# EAGLE design mSniff_v01 (EAGLE 9.6.2)

## Sheet 1 of 2
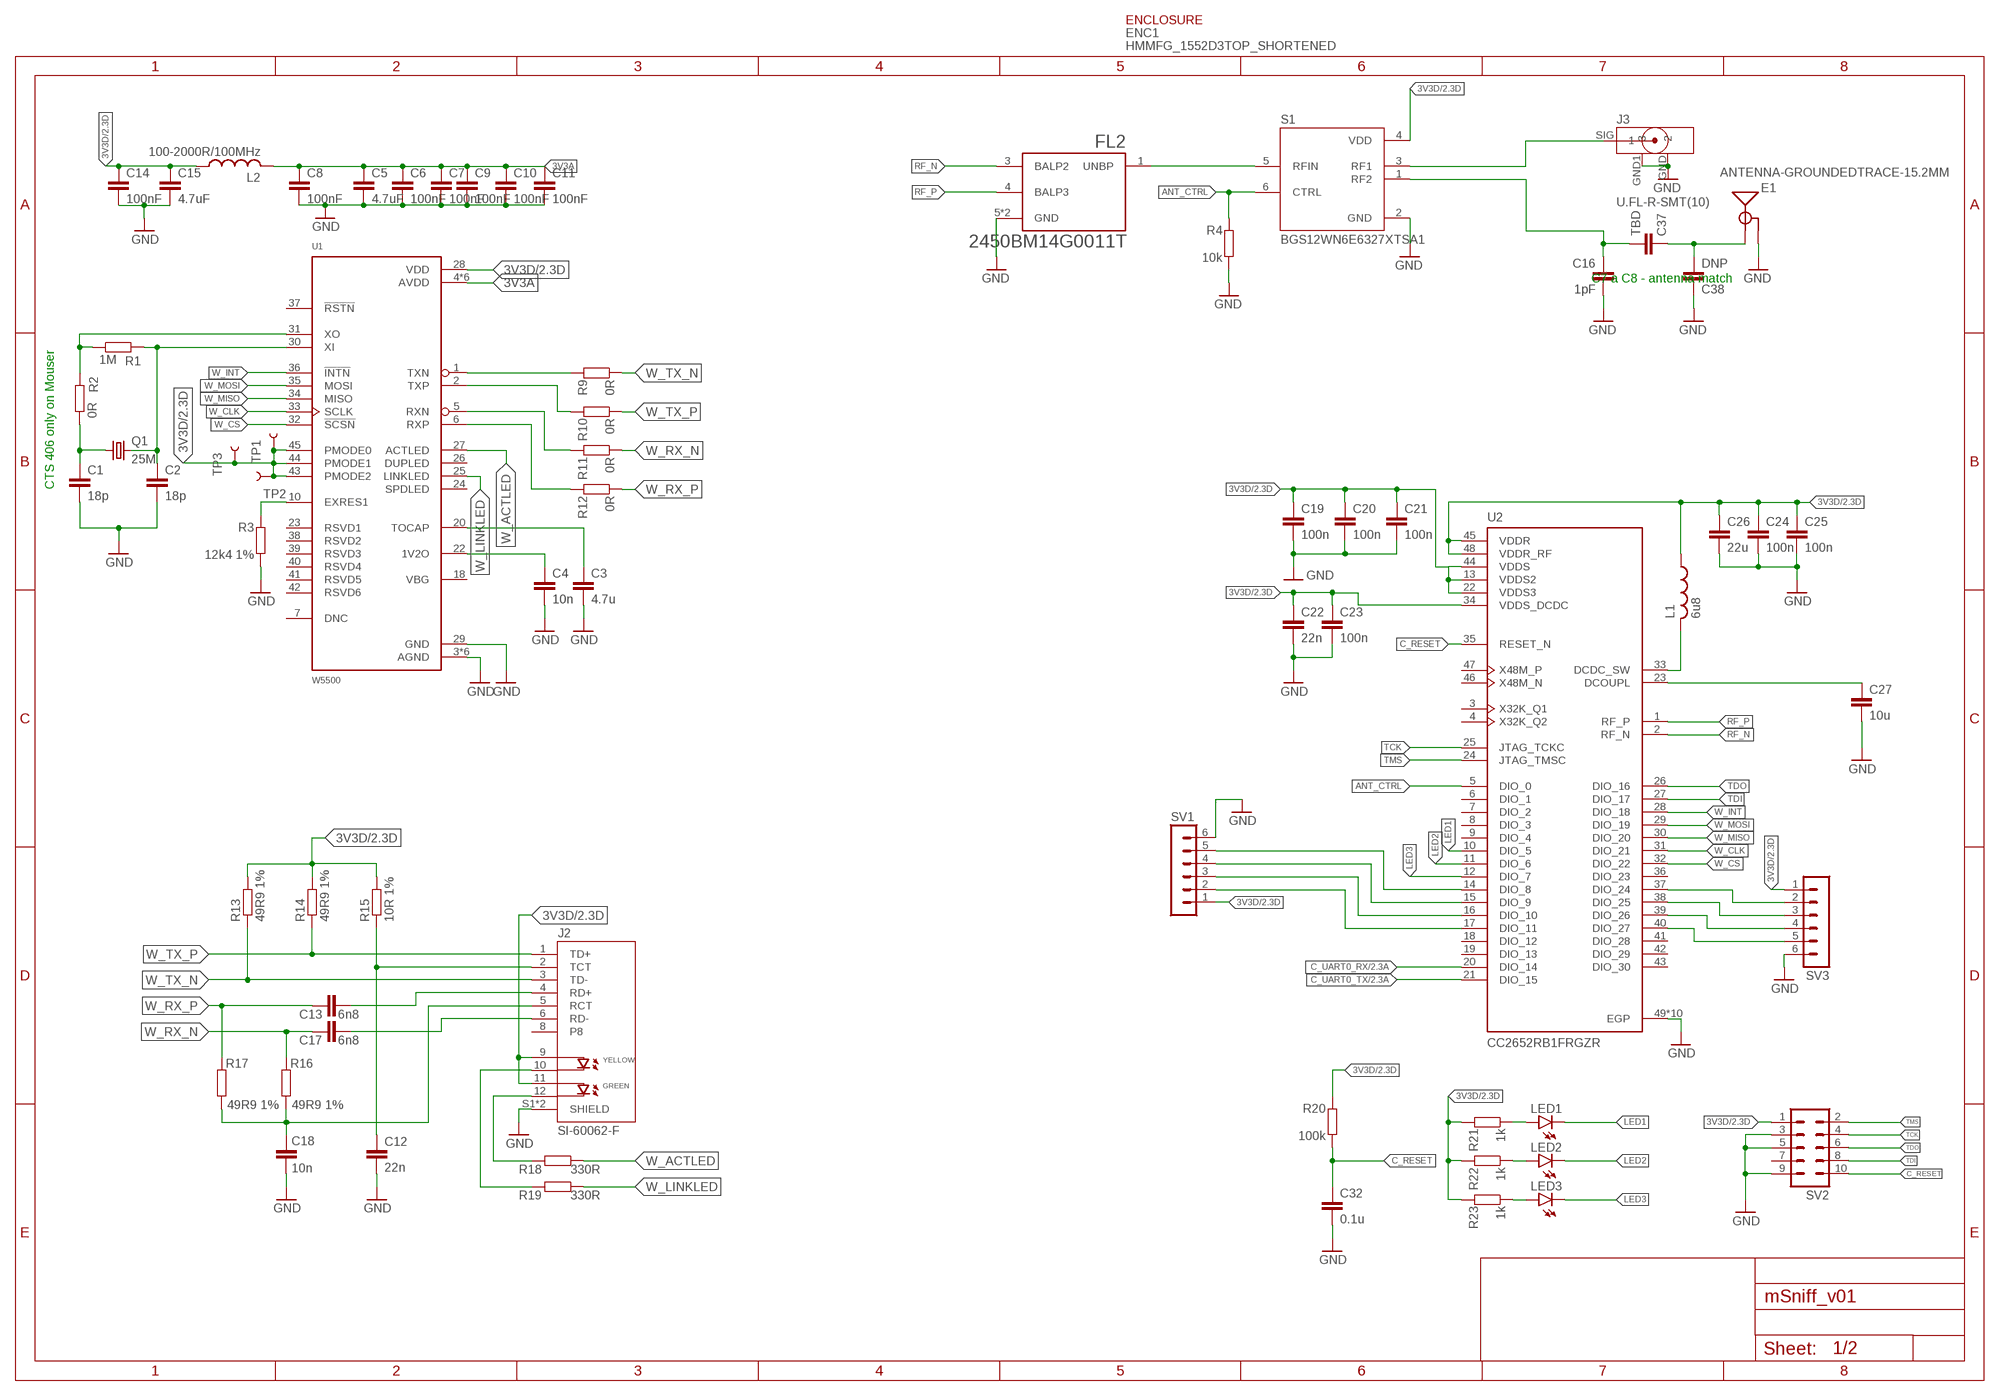
[diagram p0: schematic, sheet 1]

### Parts
C1  18p  C_0603REC  [0603REC_C]
C2  18p  C_0603REC  [0603REC_C]
C3  4.7u  C_0603REC  [0603REC_C]
C4  10n  C_0603REC  [0603REC_C]
C5  4.7uF  C_0805REC  [0805REC_C]
C6  100nF  C_0603REC  [0603REC_C]
C7  100nF  C_0603REC  [0603REC_C]
C8  100nF  C_0603REC  [0603REC_C]
C9  100nF  C_0603REC  [0603REC_C]
C10  100nF  C_0603REC  [0603REC_C]
C11  100nF  C_0603REC  [0603REC_C]
C12  22n  C_0603REC  [0603REC_C]
C13  6n8  C_0603REC  [0603REC_C]
C14  100nF  C_0603REC  [0603REC_C]
C15  4.7uF  C_0805REC  [0805REC_C]
C16  1pF  C_0402REC  [0402REC_C]
C17  6n8  C_0603REC  [0603REC_C]
C18  10n  C_0603REC  [0603REC_C]
C19  100n  C_0603REC  [0603REC_C]
C20  100n  C_0603REC  [0603REC_C]
C21  100n  C_0603REC  [0603REC_C]
C22  22n  C_0603REC  [0603REC_C]
C23  100n  C_0603REC  [0603REC_C]
C24  100n  C_0603REC  [0603REC_C]
C25  100n  C_0603REC  [0603REC_C]
C26  22u  C_0603REC  [0603REC_C]
C27  10u  C_0603REC  [0603REC_C]
C32  0.1u  C_0603REC  [0603REC_C]
C37  TBD  C_0402REC  [0402REC_C]
C38  DNP  C_0402REC  [0402REC_C]
E1  ANTENNA-GROUNDEDTRACE-15.2MM  [TRACE_ANTENNA_2.4GHZ_15.2MM]
ENC1  HMMFG_1552D3TOP_SHORTENED  [1552D3_TOP_SHORT]
FL2  2450BM14G0011T  [BALUN_2450BM14G0011T]
J2  SI-60062-F  [BEL_SI-60062-F]
J3  U.FL-R-SMT(10)  [U.FL-R-SMT(10)]
L1  6u8  L_0805REC  [0805REC_L]
L2  100-2000R/100MHz  L_0603REC  [0603REC_L]
LED1  LEDCHIPLED_0603  [CHIPLED_0603]
LED2  LEDCHIPLED_0603  [CHIPLED_0603]
LED3  LEDCHIPLED_0603  [CHIPLED_0603]
Q1  25M  CRYSTALCTS406  [CTS406]
R1  1M  R_0603REC  [0603REC_R]
R2  0R  R_0603REC  [0603REC_R]
R3  12k4 1%  R_0603REC  [0603REC_R]
R4  10k  R_0603REC  [0603REC_R]
R9  0R  R_0603REC  [0603REC_R]
R10  0R  R_0603REC  [0603REC_R]
R11  0R  R_0603REC  [0603REC_R]
R12  0R  R_0603REC  [0603REC_R]
R13  49R9 1%  R_0603REC  [0603REC_R]
R14  49R9 1%  R_0603REC  [0603REC_R]
R15  10R 1%  R_0603REC  [0603REC_R]
R16  49R9 1%  R_0603REC  [0603REC_R]
R17  49R9 1%  R_0603REC  [0603REC_R]
R18  330R  R_0603REC  [0603REC_R]
R19  330R  R_0603REC  [0603REC_R]
R20  100k  R_0603REC  [0603REC_R]
R21  1k  R_0603REC  [0603REC_R]
R22  1k  R_0603REC  [0603REC_R]
R23  1k  R_0603REC  [0603REC_R]
S1  BGS12WN6E6327XTSA1  [SW_BGS12WN6E6327XTSA1]
SV1  MA06-1  [MA06-1]
SV2  MA05-2SMD127  [MA05-2-SMD127-GPEC214]
SV3  MA06-1  [MA06-1]
TP1  TEST-POINT3  [PAD.03X.03]
TP2  TEST-POINT3  [PAD.03X.03]
TP3  TEST-POINT3  [PAD.03X.03]
U1  W5500  [QFP50P900X900X160-48N]
U2  CC2652RB1FRGZR  [QFN50P700X700X100-49N]

### Nets
3V3A: C5.1 C6.1 C7.1 C8.1 C9.1 C10.1 C11.1 L2.2 U1.4(AVDD) U1.8(AVDD) U1.11(AVDD) U1.15(AVDD) U1.17(AVDD) U1.21(AVDD)
3V3D: C14.1 C15.1 C19.1 C20.1 C21.1 C22.1 C23.1 C24.1 C25.1 C26.1 J2.9(YA) J2.11(GA) L1.1 L2.1 R13.2 R14.2 R15.2 R20.2 R21.2 R22.2 R23.2 S1.4(VDD) SV1.1 SV2.1 SV3.1 TP1.P$1 TP2.P$1 TP3.P$1 U1.28(VDD) U1.43(PMODE2) U1.44(PMODE1) U1.45(PMODE0) U2.13(VDDS2) U2.22(VDDS3) U2.34(VDDS_DCDC) U2.44(VDDS) U2.45(VDDR) U2.48(VDDR_RF) ; also sheet 2
ANT_CTRL: R4.2 S1.6(CTRL) U2.5(DIO_0)
C_RESET: C32.1 R20.1 SV2.10 U2.35(RESET_N)
C_UART0_RX: U2.20(DIO_14) ; also sheet 2
C_UART0_TX: U2.21(DIO_15) ; also sheet 2
GND: C1.2 C2.2 C3.2 C4.2 C5.2 C6.2 C7.2 C8.2 C9.2 C10.2 C11.2 C12.2 C14.2 C15.2 C16.2 C18.1 C19.2 C20.2 C21.2 C22.2 C23.2 C24.2 C25.2 C26.2 C27.2 C32.2 C38.1 E1.GND FL2.5(GND) FL2.6(GND) J2.S1(SHIELD) J2.S2(SHIELD) J3.GND J3.GND1 R3.1 R4.1 S1.2(GND) SV1.6 SV2.3 SV2.5 SV2.9 SV3.6 U1.3(AGND) U1.9(AGND) U1.14(AGND) U1.16(AGND) U1.19(AGND) U1.29(GND) U1.48(AGND) U2.49(EGP) U2.50(EGP) U2.51(EGP) U2.52(EGP) U2.53(EGP) U2.54(EGP) U2.55(EGP) U2.56(EGP) U2.57(EGP) U2.58(EGP) ; also sheet 2
LED1: LED1.C U2.10(DIO_5)
LED2: LED2.C U2.11(DIO_6)
LED3: LED3.C U2.12(DIO_7)
N$1: C2.1 Q1.3 R1.2 U1.30(XI)
N$2: R1.1 R2.2 U1.31(XO)
N$3: C1.1 Q1.1 R2.1
N$4: C4.1 U1.22(1V2O)
N$5: R3.2 U1.10(EXRES1)
N$6: C16.1 C37.2 S1.1(RF2)
N$7: C3.1 U1.20(TOCAP)
N$8: SV1.5 U2.14(DIO_8)
N$9: FL2.1(UNBP) S1.5(RFIN)
N$10: SV1.4 U2.15(DIO_9)
N$11: SV1.3 U2.16(DIO_10)
N$12: SV1.2 U2.17(DIO_11)
N$13: J3.SIG S1.3(RF1)
N$14: SV3.2 U2.37(DIO_24)
N$15: C37.1 C38.2 E1.ANT(SIGNAL)
N$16: SV3.3 U2.38(DIO_25)
N$17: SV3.4 U2.39(DIO_26)
N$18: C12.1 J2.2(TCT) R15.1
N$19: SV3.5 U2.40(DIO_27)
N$20: C27.1 U2.23(DCOUPL)
N$21: J2.12(GK) R18.2
N$22: C18.2 J2.5(RCT) R16.1 R17.1
N$23: J2.10(YK) R19.2
N$25: L1.2 U2.33(DCDC_SW)
N$29: LED1.A R21.1
N$31: LED2.A R22.1
N$32: LED3.A R23.1
RD_N [Ether]: C17.2 J2.6(RD-)
RD_P [Ether]: C13.2 J2.4(RD+)
RF_N: FL2.3(BALP2) U2.2(RF_N)
RF_P: FL2.4(BALP3) U2.1(RF_P)
RX_N [Ether]: R11.2 U1.5(RXN)
RX_P [Ether]: R12.2 U1.6(RXP)
TCK: SV2.4 U2.25(JTAG_TCKC)
TDI: SV2.8 U2.27(DIO_17)
TDO: SV2.6 U2.26(DIO_16)
TMS: SV2.2 U2.24(JTAG_TMSC)
TX_N [Ether]: R9.2 U1.1(TXN)
TX_P [Ether]: R10.2 U1.2(TXP)
W_ACTLED: R18.1 U1.27(ACTLED)
W_CLK: U1.33(SCLK) U2.31(DIO_21)
W_CS: U1.32(!SCSN) U2.32(DIO_22)
W_INT: U1.36(!INTN) U2.28(DIO_18)
W_LINKLED: R19.1 U1.25(LINKLED)
W_MISO: U1.34(MISO) U2.30(DIO_20)
W_MOSI: U1.35(MOSI) U2.29(DIO_19)
W_RX_N [Ether]: C17.1 R11.1 R16.2
W_RX_P [Ether]: C13.1 R12.1 R17.2
W_TX_N [Ether]: J2.3(TD-) R9.1 R13.1
W_TX_P [Ether]: J2.1(TD+) R10.1 R14.1
Unconnected: J2.8 SV2.7 U1.7(DNC) U1.18(VBG) U1.23(RSVD1) U1.24(SPDLED) U1.26(DUPLED) U1.37(!RSTN) U1.38(RSVD2) U1.39(RSVD3) U1.40(RSVD4) U1.41(RSVD5) U1.42(RSVD6) U2.3(X32K_Q1) U2.4(X32K_Q2) U2.6(DIO_1) U2.7(DIO_2) U2.8(DIO_3) U2.9(DIO_4) U2.18(DIO_12) U2.19(DIO_13) U2.36(DIO_23) U2.41(DIO_28) U2.42(DIO_29) U2.43(DIO_30) U2.46(X48M_N) U2.47(X48M_P)

### Notes on the sheet
- C7 a C8 - antenna match
- CTS 406 only on Mouser

## Sheet 2 of 2
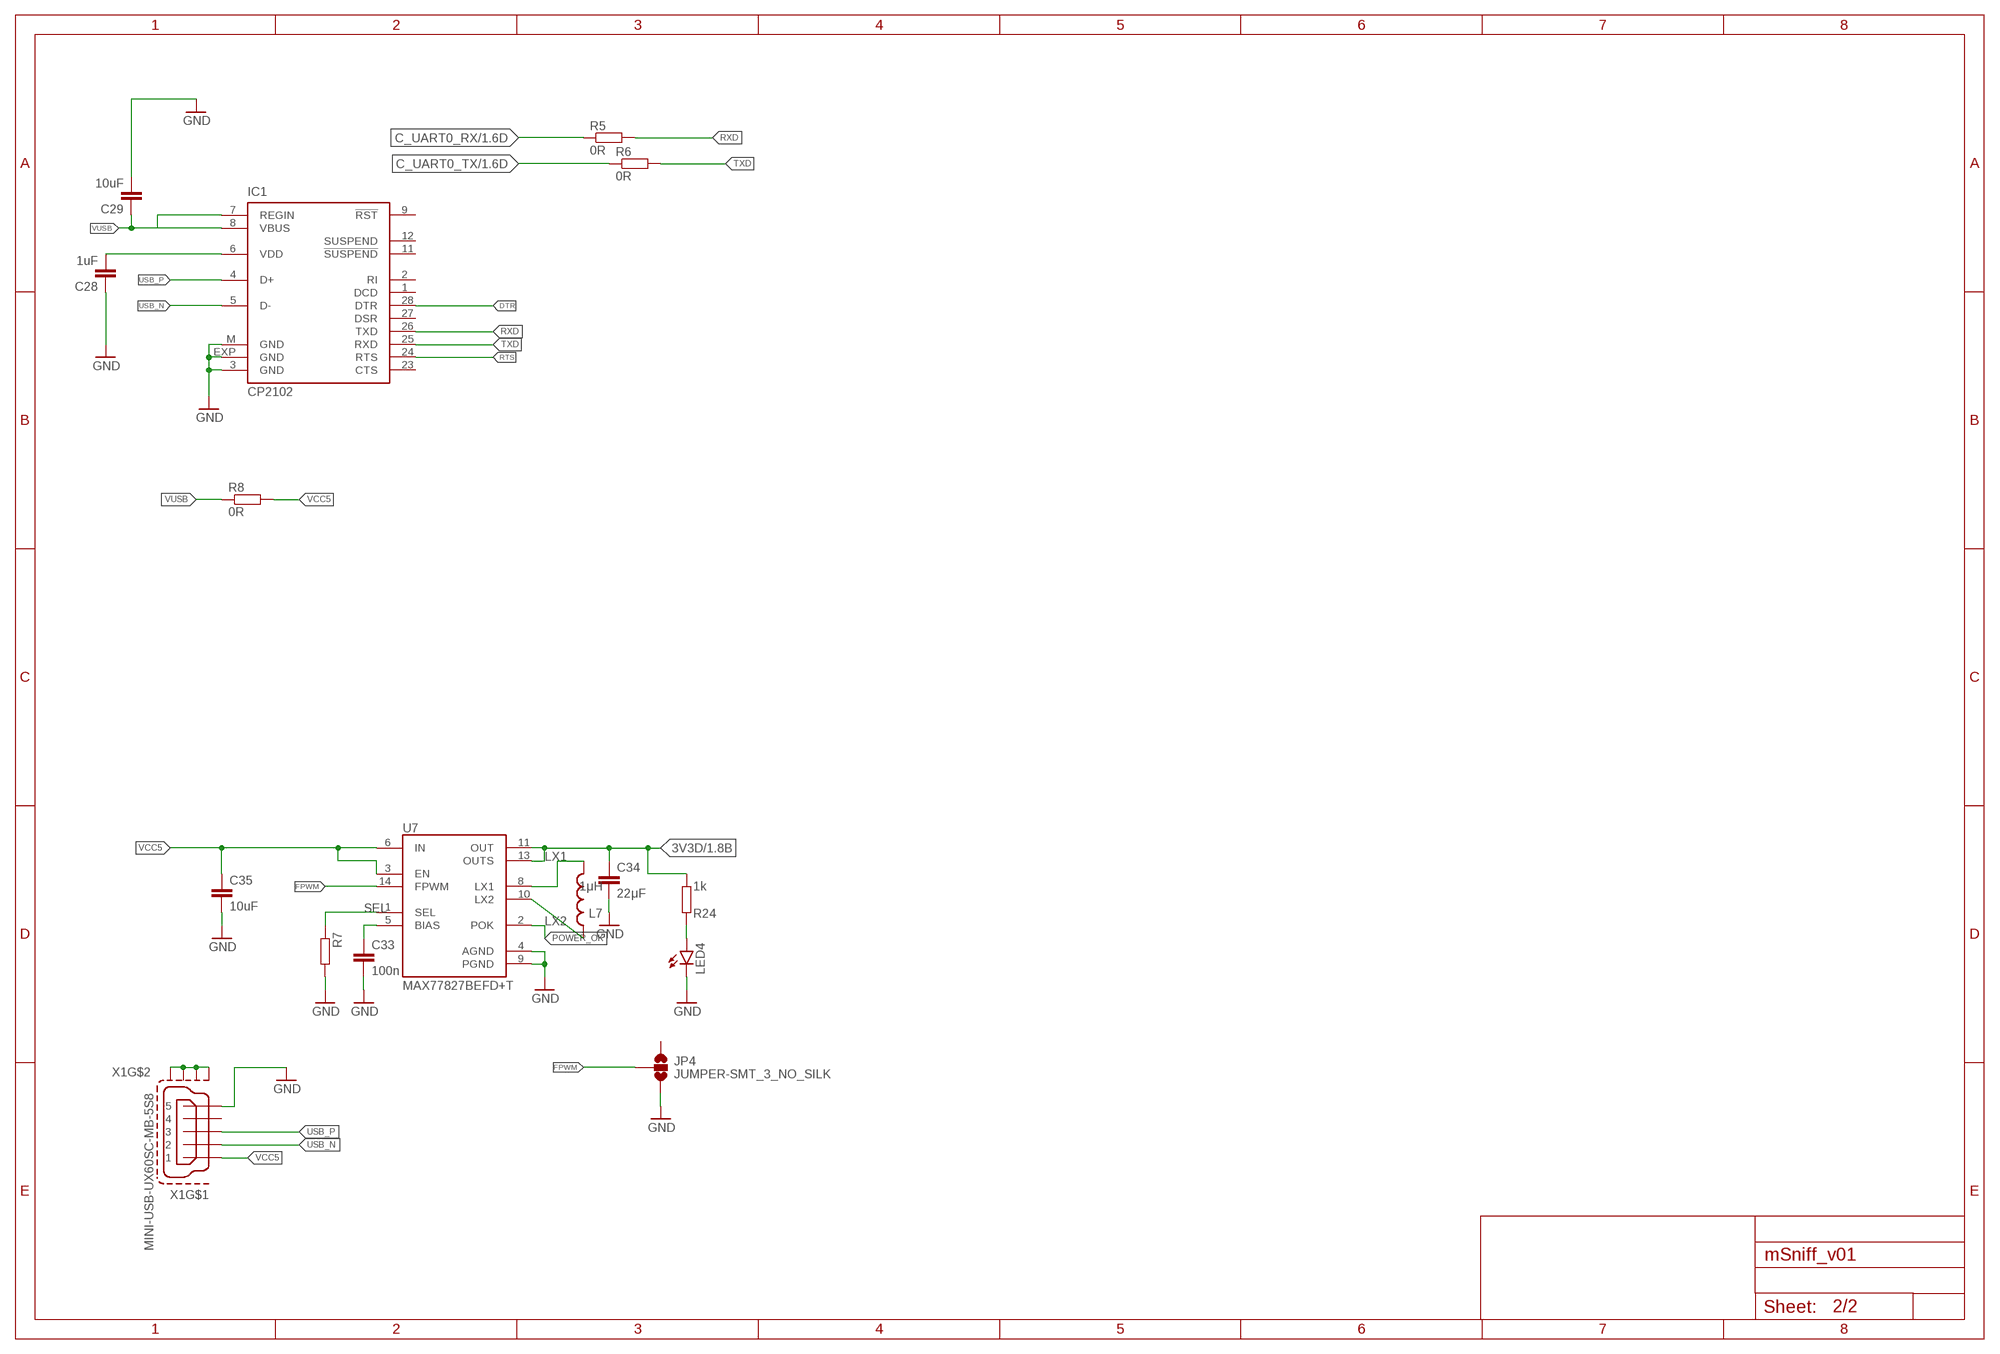
[diagram p1: schematic, sheet 2]

### Parts
C28  1uF  C_0603REC  [0603REC_C]
C29  10uF  C_0603REC  [0603REC_C]
C33  100n  C_0603REC  [0603REC_C]
C34  22μF  C_0603REC  [0603REC_C]
C35  10uF  C_0603REC  [0603REC_C]
IC1  CP2102  [MLP28]
JP4  JUMPER-SMT_3_NO_SILK  [SMT-JUMPER_3_NO_SILK]
L7  1μH  L_1008REC  [1008REC_L]
LED4  LEDCHIPLED_0603  [CHIPLED_0603]
R5  0R  R_0603REC  [0603REC_R]
R6  0R  R_0603REC  [0603REC_R]
R7  R_0603REC  [0603REC_R]
R8  0R  R_0603REC  [0603REC_R]
R24  1k  R_0603REC  [0603REC_R]
U7  MAX77827BEFD+T  [CONV_MAX77827BEFD+T]
X1  MINI-USB-UX60SC-MB-5S8  [HIROSE_UX60SC-MB-5S8]

### Nets
3V3D: C34.1 R24.1 U7.11(OUT) U7.13(OUTS) ; also sheet 1
BIAS: C33.1 U7.5(BIAS)
C_UART0_RX: R5.1 ; also sheet 1
C_UART0_TX: R6.1 ; also sheet 1
DTR: IC1.28(DTR)
FPWM: JP4.2 U7.14(FPWM)
GND: C28.1 C29.2 C33.2 C34.2 C35.2 IC1.3(GND) IC1.EXP(GND) IC1.M(GND) JP4.3 LED4.C R7.2 U7.4(AGND) U7.9(PGND) X1.5 ; also sheet 1
LX1: L7.2 U7.8(LX1)
LX2: L7.1 U7.10(LX2)
N$24: LED4.A R24.2
N$27: X1.S1 X1.S2 X1.S3 X1.S4
N$30: C28.2 IC1.6(VDD)
POWER_OK: U7.2(POK)
RTS: IC1.24(RTS)
RXD: IC1.26(TXD) R5.2
SEL: R7.1 U7.1(SEL)
TXD: IC1.25(RXD) R6.2
USB_N [USB]: IC1.5(D-) X1.2
USB_P [USB]: IC1.4(D+) X1.3
VCC5: C35.1 R8.2 U7.3(EN) U7.6(IN) X1.1
VUSB: C29.1 IC1.7(REGIN) IC1.8(VBUS) R8.1
Unconnected: IC1.1(DCD) IC1.2(RI) IC1.9(!RST) IC1.11(!SUSPEND) IC1.12(SUSPEND) IC1.23(CTS) IC1.27(DSR) JP4.1 X1.4

## Library data of the parts
C1-C29 C32-C35 C37 C38 = rcl-reflow-pads:C_: Capacitors with recommended reflow pad dimensions (to prevent tombstoning)
E1 = SparkFun-RF:ANTENNA-GROUNDED: Antenna w/ Ground Connection 2.4GHz antennae with signal and ground terminals. TRACE_ANTENNA_2.4GHZ_15.2MM - Meander Trace antenna 15.2 x 5.7mm footprint Based on layout from TI app note AN043 <http://www.ti.com/lit/an/swra117d/swra117d.pdf>. TRACE_ANTENNA_2.4GHZ_25.7MM - Inverted F trace antenna 25.7 x 7.5 mm footprint. Based on layout from TI design note DN0007 <http://www.ti.com/lit/an/swru120b/swru120b.pdf>.
ENC1 = O_enclosures:HMMFG_1552D3
FL2 = O_Anteny:2450BM14G0011T: BALUN-BPF TI CC2640 CC2650 MATCH Check prices <https://pricing.snapeda.com/parts/2450BM14G0011T/Johanson%20Technology/view-part?ref=eda>; AVAILABILITY: Warning; DESCRIPTION: RF Balun 2.4GHz ~ 2.5GHz 50 / -Ohm 0603 (1608 Metric); MF: Johanson Technology; MP: 2450BM14G0011T; PACKAGE: 0603 Johanson; PRICE: None; PURCHASE-URL: https://pricing.snapeda.com/search/part/2450BM14G0011T/?ref=eda
IC1 = mega_board:CP210*: Single-Chip USB to UART Bridge Source: www.silabs.com .. CP2101.pdf / cp2102.pdf; MF: FARNELL; MPN: CP2102-GM; OC_FARNELL: 9282130; OC_NEWARK: 30K5635
J2 = SI-60062-F:SI-60062-F: 1 Port RJ45 Magjack Connector Through Hole 10/100 Base-T, AutoMDIX Check prices <https://pricing.snapeda.com/parts/SI-60062-F/Bel%20Magnetic%20Solutions/view-part?ref=eda>; AVAILABILITY: Warning; DESCRIPTION: Conn RJ-45 RCP 8 POS 2.54mm Solder RA Thru-Hole 12 Terminal 1 Port; MF: Bel Magnetic Solutions; MP: SI-60062-F; PACKAGE: None; PRICE: None; PURCHASE-URL: https://pricing.snapeda.com/search/part/SI-60062-F/?ref=eda
J3 = Connectors:U.FL-R-SMT(10): CONN U.FL RCPT STR 50 OHM SMD Manufacturer's datasheet <https://media.digikey.com/pdf/Data%20Sheets/Hirose%20PDFs/UFL%20Series.pdf>; CREATED_BY: PCBLayout.com; DIGIKEY_PART_NUMBER: H9161CT-ND; MANUFACTURER: Hirose Electric Co Ltd; MPN: U.FL-R-SMT(10); PACKAGE: SMD
JP4 = O_test_solpad:JUMPER-SMT_3_NO: Normally open jumper This jumper has three pads in close proximity to each other. Apply solder to close the connection(s).
L1 L2 L7 = rcl-reflow-pads:L_: Inductors with recommended reflow pad dimensions (to prevent tombstoning)
LED1-LED4 = O_semicon:LED: LED OSRAM: - CHIPLED LG R971, LG N971, LY N971, LG Q971, LY Q971, LO R971, LY R971 LH N974, LH R974 LS Q976, LO Q976, LY Q976 LO Q996 - Hyper CHIPLED LW Q18S LB Q993, LB Q99A, LB R99A - SideLED LS A670, LO A670, LY A670, LG A670, LP A670 LB A673, LV A673, LT A673, LW A673 LH A674 LY A675 LS A676, LA A676, LO A676, LY A676, LW A676 LS A679, LY A679, LG A679 - Hyper Micro SIDELED® LS Y876, LA Y876, LO Y876, LY Y876 LT Y87S - SmartLED LW L88C, LW L88S LB L89C, LB L89S, LG L890 LS L89K, LO L89K, LY L89K LS L896, LA L896, LO L896, LY L896 - TOPLED LS T670, LO T670, LY T670, LG T670, LP T670 LSG T670, LSP T670, LSY T670, LOP T670, LYG T670 LG T671, LOG T671, LSG T671 LB T673, LV T673, LT T673, LW T673 LH T674 LS T676, LA T676, LO T676, LY T676, LB T676, LH T676, LSB T676, LW T676 LB T67C, LV T67C, LT T67C, LS T67K, LO T67K, LY T67K, LW E67C LS E67B, LA E67B, LO E67B, LY E67B, LB E67C, LV E67C, LT E67C LW T67C LS T679, LY T679, LG T679 LS T770, LO T770, LY T770, LG T770, LP T770 LB T773, LV T773, LT T773, LW T773 LH T774 LS E675, LA E675, LY E675, LS T675 LS T776, LA T776, LO T776, LY T776, LB T776 LHGB T686 LT T68C, LB T68C - Hyper Mini TOPLED® LB M676 - Mini TOPLED Santana® LG M470 LS M47K, LO M47K, LY M47K Source: http://www.osram.convergy.de LUXEON: - LUMILED® LXK2-PW12-R00, LXK2-PW12-S00, LXK2-PW14-U00, LXK2-PW14-V00 LXK2-PM12-R00, LXK2-PM12-S00, LXK2-PM14-U00 LXK2-PE12-Q00, LXK2-PE12-R00, LXK2-PE12-S00, LXK2-PE14-T00, LXK2-PE14-U00 LXK2-PB12-K00, LXK2-PB12-L00, LXK2-PB12-M00, LXK2-PB14-N00, LXK2-PB14-P00, LXK2-PB14-Q00 LXK2-PR12-L00, LXK2-PR12-M00, LXK2-PR14-Q00, LXK2-PR14-R00 LXK2-PD12-Q00, LXK2-PD12-R00, LXK2-PD12-S00 LXK2-PH12-R00, LXK2-PH12-S00 LXK2-PL12-P00, LXK2-PL12-Q00, LXK2-PL12-R00 Source: www.luxeon.com KINGBRIGHT: KA-3528ASYC Source: www.kingbright.com
Q1 = crystal:CRYSTAL: CRYSTAL; OC_FARNELL: unknown; OC_NEWARK: unknown
R1-R24 = rcl-reflow-pads:R_: Resistors with recommended reflow pad dimensions (to prevent tombstoning)
S1 = O_Anteny:BGS12WN6E6327XTSA1: RF Switch SPDT 50MHz to 6GHz 21dB T/R Check prices <https://pricing.snapeda.com/parts/BGS12WN6E6327XTSA1/Infineon%20Technologies/view-part?ref=eda>; AVAILABILITY: In Stock; DESCRIPTION: RF Switch IC WLAN SPDT 50Ohm PG-TSNP-6-10; MF: Infineon Technologies; MP: BGS12WN6E6327XTSA1; PACKAGE: TSNP-6 Infineon Technologies; PRICE: None; PURCHASE-URL: https://pricing.snapeda.com/search/part/BGS12WN6E6327XTSA1/?ref=eda
SV1 SV3 = O_Header:MA06-1: PIN HEADER; OC_FARNELL: unknown; OC_NEWARK: unknown
SV2 = O_Header:MA05-2: PIN HEADER
TP1-TP3 = O_test_solpad:TEST-POINT: SparkFun Test Points Bare copper test points for troubleshooting or In-Circuit-Testing. These are used by our Production team for verifying production board runs using pogo-pins on test beds. SparkFun Products: SparkFun LSM9DS1 Breakout <https://www.sparkfun.com/products/13284> SparkFun PSOC <https://www.sparkfun.com/products/13714> SparkFun Load Cell Amplifier <https://www.sparkfun.com/products/13879>
U1 = W5500:W5500: Hardwired TCP/IP embedded Ethernet controller Check availability <https://pricing.snapeda.com/parts/W5500/WIZnet/view-part?ref=eda>; AVAILABILITY: In Stock; DESCRIPTION: Ethernet Controller 10/100 Base-T/TX PHY SPI Interface 48-LQFP (7x7); MF: WIZnet; MP: W5500; PACKAGE: LQFP-48 WIZnet; PRICE: None; PURCHASE-URL: https://pricing.snapeda.com/search/part/W5500/?ref=eda
U2 = CC2652RB1FRGZR:CC2652RB1FRGZR: Check availability <https://pricing.snapeda.com/parts/CC2652RB1FRGZR/Texas%20Instruments/view-part?ref=eda>; AVAILABILITY: In Stock; DESCRIPTION: SimpleLink™ 32-bit Arm Cortex-M4F multiprotocol 2.4 GHz wireless MCU with crystal-less BAW resonator; MF: Texas Instruments; MP: CC2652RB1FRGZR; PACKAGE: VQFN-48 Texas Instruments; PRICE: None; PURCHASE-URL: https://pricing.snapeda.com/search/part/CC2652RB1FRGZR/?ref=eda
U7 = MAX77827BEFD_T:MAX77827BEFD+T: Buck-Boost Switching Regulator IC Positive Adjustable 2.3V 1 Output 1.6A 14-PowerUFQFN Check availability <https://pricing.snapeda.com/parts/MAX77827BEFD%2BT/Analog%20Devices/view-part?ref=eda>; AVAILABILITY: In Stock; DESCRIPTION: 5.5V Input, 1.8A/3.1A Switch Buck-Boost Converter with 6μA IQ; MF: Analog Devices; MP: MAX77827BEFD+T; PACKAGE: None; PRICE: None; PURCHASE-URL: https://pricing.snapeda.com/search/part/MAX77827BEFD+T/?ref=eda
X1 = O_Sw_Conn_Head:MINI-USB-: MINI USB Connector Source: http://www.hirose.co.jp/cataloge_hp/e24000019.pdf

## Net classes
1 USB: width 0.3 mm, clearance 0.127 mm
2 Ether: width 0.3 mm, clearance 0.127 mm

## Board
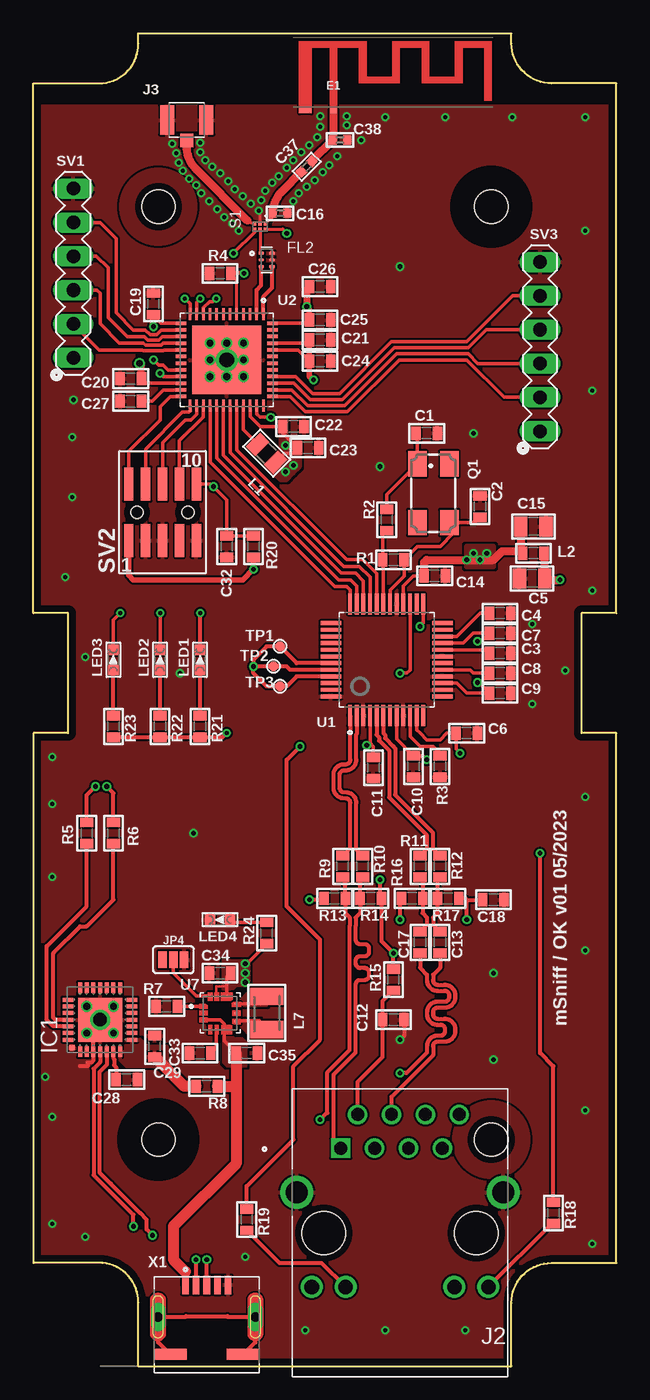
[diagram p2: board, top side]
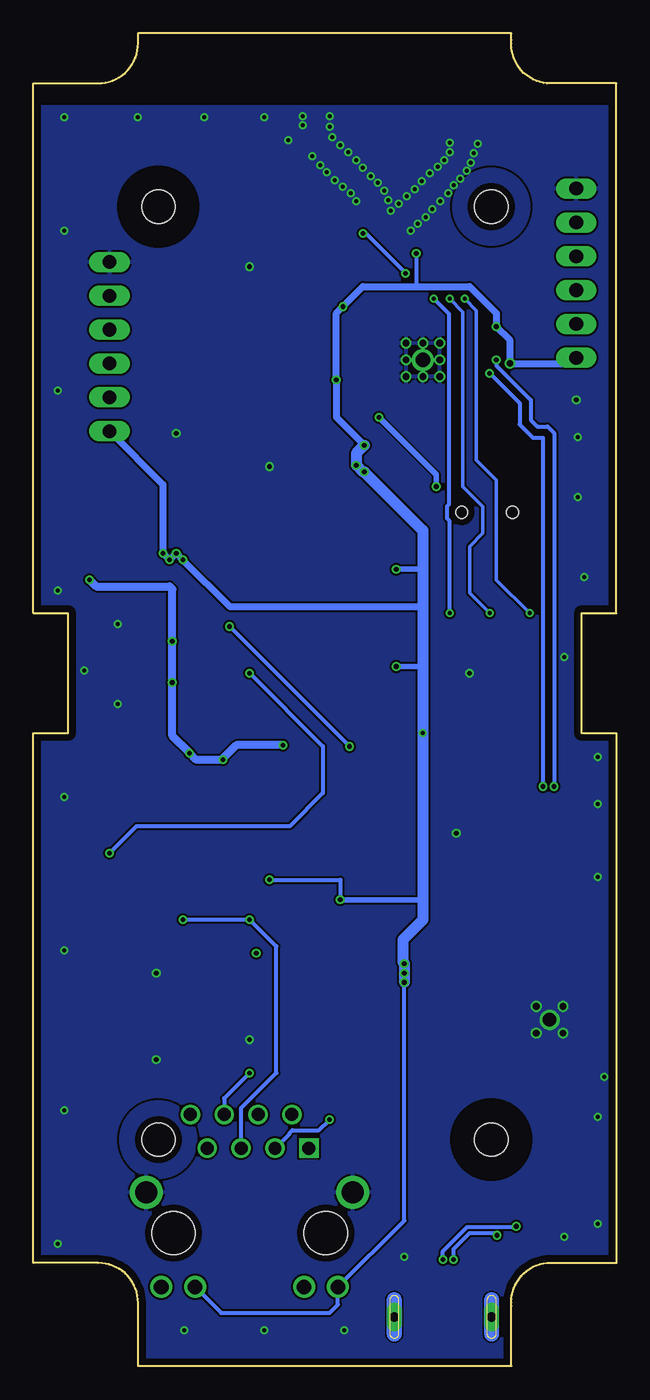
[diagram p3: board, bottom side, seen from below]

Size 43.72 x 100 mm. Coordinates in mm from the lower left corner, seen from the top.
Copper layers (1*16): Top 0.035mm / dielectric 1.5mm / Bottom 0.035mm
Design rules "2 vrstvy trida 6": minimum track width 0.15mm, minimum drill 0.3mm, track to track 0.15mm, track to pad 0.15mm, pad to pad 0.15mm, via to via 0.15mm, smd to smd 0.15mm, copper to edge 0.5mm, drill to drill 0.3mm, minimum pad ring 0.15mm, minimum via ring 0.15mm, stop-mask expansion 0.1mm, vias tented up to drill 3mm, thermal gap 0.15mm

### Footprints (pad centres in the part's own frame; a part is rotated, then mirrored left to right if it is on the bottom)
0603REC_C = smd 0.7 x 1: 1 -0.8,0; 2 0.8,0
0805REC_C = smd 1 x 1.5: 1 -0.95,0; 2 0.95,0
0402REC_C = smd 0.6 x 0.7: 1 -0.55,0; 2 0.55,0
TRACE_ANTENNA_2.4GHZ_15.2MM = smd 0.5 x 0.5: ANT 0,-0.25 | smd 0.9 x 0.5: GND -2.1,-0.25
1552D3_TOP_SHORT = hole 2.5: 17,34.345; 17,9.375; 87,34.345; 87,9.375
BALUN_2450BM14G0011T = smd 0.45 x 0.25: 1 -0.41,0.5; 2 -0.41,0; 3 -0.41,-0.5; 4 0.41,-0.5; 5 0.41,0; 6 0.41,0.5
MLP28 = smd 0.8 x 0.3: 1 -2.4,1.5; 2 -2.4,1; 3 -2.4,0.5; 4 -2.4,0; 5 -2.4,-0.5; 6 -2.4,-1; 7 -2.4,-1.5; 15 2.4,-1.5; 16 2.4,-1; 17 2.4,-0.5; 18 2.4,0; 19 2.4,0.5; 20 2.4,1; 21 2.4,1.5 | smd 0.3 x 0.8: 8 -1.5,-2.4; 9 -1,-2.4; 10 -0.5,-2.4; 11 0,-2.4; 12 0.5,-2.4; 13 1,-2.4; 14 1.5,-2.4; 22 1.5,2.4; 23 1,2.4; 24 0.5,2.4; 25 0,2.4; 26 -0.5,2.4; 27 -1,2.4; 28 -1.5,2.4 | smd 3.3 x 3.3: EXP 0,0 | smd 0.435 x 0.435: M -2.103,2.103
BEL_SI-60062-F = drill 0.97 square: 1 -4.445,6.35 | drill 0.97: 2 -3.175,8.89; 3 -1.905,6.35; 4 -0.635,8.89; 5 0.635,6.35; 6 1.905,8.89; 7 3.175,6.35; 8 4.445,8.89 | drill 1.1: 9 -6.625,-4.06; 10 -4.085,-4.06; 11 4.085,-4.06; 12 6.625,-4.06 | drill 1.65: S1 -7.745,3.05; S2 7.745,3.05 | hole 3.25: 5.715,0; -5.715,0
U.FL-R-SMT(10) = smd 1.05 x 2.2: GND -1.475,0; GND1 1.475,0 | smd 1 x 1: SIG 0,-1.525
SMT-JUMPER_3_NO_SILK = smd 0.635 x 1.27: 1 -0.813,0; 2 0,0; 3 0.813,0
0805REC_L = smd 1 x 1.5: 1 -0.95,0; 2 0.95,0
0603REC_L = smd 0.7 x 1: 1 -0.8,0; 2 0.8,0
1008REC_L = smd 1.3 x 2.5: 1 -1.25,0; 2 1.25,0
CHIPLED_0603 = smd 0.8 x 0.8: A 0,-0.75; C 0,0.75
CTS406 = smd 1.9 x 1.4: 1 -2.2,-1.2; 2 2.2,-1.2; 3 2.2,1.2; 4 -2.2,1.2
0603REC_R = smd 0.7 x 1: 1 -0.8,0; 2 0.8,0
SW_BGS12WN6E6327XTSA1 = smd 0.25 x 0.25: 1 -0.2,0.4; 2 -0.2,0; 3 -0.2,-0.4; 4 0.2,-0.4; 5 0.2,0; 6 0.2,0.4
MA06-1 = drill 1.016 long: 1 -6.35,0; 2 -3.81,0; 3 -1.27,0; 4 1.27,0; 5 3.81,0; 6 6.35,0
MA05-2-SMD127-GPEC214 = smd 2.48 x 0.7: 1 -2.54,6.35; 2 1.68,6.35; 3 -2.54,5.08; 4 1.68,5.08; 5 -2.54,3.81; 6 1.68,3.81; 7 -2.54,2.54; 8 1.68,2.54; 9 -2.54,1.27; 10 1.68,1.27 | hole 0.9: -0.445,5.715; -0.445,1.905
PAD.03X.03 = smd 0.762 x 0.762: P$1 0,0
QFP50P900X900X160-48N = smd 1.56 x 0.28: 1 -4.18,2.75; 2 -4.18,2.25; 3 -4.18,1.75; 4 -4.18,1.25; 5 -4.18,0.75; 6 -4.18,0.25; 7 -4.18,-0.25; 8 -4.18,-0.75; 9 -4.18,-1.25; 10 -4.18,-1.75; 11 -4.18,-2.25; 12 -4.18,-2.75; 25 4.18,-2.75; 26 4.18,-2.25; 27 4.18,-1.75; 28 4.18,-1.25; 29 4.18,-0.75; 30 4.18,-0.25; 31 4.18,0.25; 32 4.18,0.75; 33 4.18,1.25; 34 4.18,1.75; 35 4.18,2.25; 36 4.18,2.75 | smd 0.28 x 1.56: 13 -2.75,-4.18; 14 -2.25,-4.18; 15 -1.75,-4.18; 16 -1.25,-4.18; 17 -0.75,-4.18; 18 -0.25,-4.18; 19 0.25,-4.18; 20 0.75,-4.18; 21 1.25,-4.18; 22 1.75,-4.18; 23 2.25,-4.18; 24 2.75,-4.18; 37 2.75,4.18; 38 2.25,4.18; 39 1.75,4.18; 40 1.25,4.18; 41 0.75,4.18; 42 0.25,4.18; 43 -0.25,4.18; 44 -0.75,4.18; 45 -1.25,4.18; 46 -1.75,4.18; 47 -2.25,4.18; 48 -2.75,4.18
QFN50P700X700X100-49N = smd 0.86 x 0.26: 1 -3.435,2.75; 2 -3.435,2.25; 3 -3.435,1.75; 4 -3.435,1.25; 5 -3.435,0.75; 6 -3.435,0.25; 7 -3.435,-0.25; 8 -3.435,-0.75; 9 -3.435,-1.25; 10 -3.435,-1.75; 11 -3.435,-2.25; 12 -3.435,-2.75; 25 3.435,-2.75; 26 3.435,-2.25; 27 3.435,-1.75; 28 3.435,-1.25; 29 3.435,-0.75; 30 3.435,-0.25; 31 3.435,0.25; 32 3.435,0.75; 33 3.435,1.25; 34 3.435,1.75; 35 3.435,2.25; 36 3.435,2.75 | smd 0.26 x 0.86: 13 -2.75,-3.435; 14 -2.25,-3.435; 15 -1.75,-3.435; 16 -1.25,-3.435; 17 -0.75,-3.435; 18 -0.25,-3.435; 19 0.25,-3.435; 20 0.75,-3.435; 21 1.25,-3.435; 22 1.75,-3.435; 23 2.25,-3.435; 24 2.75,-3.435; 37 2.75,3.435; 38 2.25,3.435; 39 1.75,3.435; 40 1.25,3.435; 41 0.75,3.435; 42 0.25,3.435; 43 -0.25,3.435; 44 -0.75,3.435; 45 -1.25,3.435; 46 -1.75,3.435; 47 -2.25,3.435; 48 -2.75,3.435 | smd 5.15 x 5.15: 49 0,0 | drill 0.5: 50 -1.26,1.26; 51 0,1.26; 52 1.26,1.26; 53 -1.26,0; 55 1.26,0; 56 -1.26,-1.26; 57 0,-1.26; 58 1.26,-1.26 | drill 1.1: 54 0,0
CONV_MAX77827BEFD+T = smd 0.1 x 0.1: 1 -1.3,0.5; 2 -1.3,0; 3 -1.3,-0.5; 4 -0.8,-1.2; 5 -0.3,-1.2; 6 0.3,-1.2; 8 1.1,-0.6; 9 1.1,0; 10 1.1,0.7; 11 0.5,1.3; 13 -0.3,1.3; 14 -0.8,1.3
HIROSE_UX60SC-MB-5S8 = smd 0.5 x 1.4: 1 -1.6,6.1; 2 -0.8,6.1; 3 0,6.1; 4 0.8,6.1; 5 1.6,6.1 | drill 0.7 pad 1.1 long: S1 -3.65,3.7; S2 3.65,3.7 | smd 2.35 x 0.8: S3 -2.675,0.9; S4 2.675,0.9

### Placement (x,y rotation side)
C1  29.5,70 0 top
C2  33.5,64.5 90 top
C3  35,53.5 0 top
C4  35,56.5 0 top
C5  37.4,59.1 180 top
C6  32.5,47.5 0 top
C7  35,55 0 top
C8  35,52 0 top
C9  35,50.5 0 top
C10  28.5,45 270 top
C11  25.5,44.9 270 top
C12  27,26 0 top
C13  30.5,31.8 270 top
C14  30.1,59.3 0 top
C15  37.5,63 0 top
C16  18.5,86.5 0 top
C17  29,31.8 270 top
C18  34.5,35 180 top
C19  9,79.7 90 top
C20  7.3,74.1 180 top
C21  21.5,77 0 top
C22  19.5,70.5 0 top
C23  20.6,68.9 0 top
C24  21.5,75.4 0 top
C25  21.5,78.5 0 top
C26  21.5,81 0 top
C27  7.3,72.4 180 top
C28  7,21.5 180 top
C29  9.1,24 90 top
C32  14.5,61.5 270 top
C33  12.5,23.5 180 top
C34  14,29.5 180 top
C35  16,23.5 0 top
C37  20.5,90 225 top
C38  23,92 180 top
E1  22.5,94.5 0 top
ENC1  0,0 90 bottom
FL2  17.5,83 0 top
IC1  5,26 90 top
J2  27.5,10 0 top
J3  11.5,93.5 0 top
JP4  10.5,30.5 0 top
L1  17.5,68.5 135 top
L2  37.5,61 0 top
L7  17.5,26.5 270 top
LED1  12.5,53 0 top
LED2  9.5,53 0 top
LED3  6,53 0 top
LED4  14,33.5 90 top
Q1  30,65.5 270 top
R1  27,60.5 0 top
R2  26.5,63.5 270 top
R3  30.5,45 90 top
R4  14,82 0 top
R5  4,40 270 top
R6  6,40 270 top
R7  10,27 180 top
R8  13,21 0 top
R9  23.2,37.5 90 top
R10  24.7,37.5 90 top
R11  29,37.5 90 top
R12  30.5,37.5 90 top
R13  22.6,35.1 180 top
R14  25.3,35.1 0 top
R15  27,29 90 top
R16  28.4,35.1 0 top
R17  31.1,35.1 180 top
R18  39,11.5 270 top
R19  16,11 270 top
R20  16.5,61.5 270 top
R21  12.5,48 270 top
R22  9.5,48 270 top
R23  6,48 270 top
R24  17.5,32.5 90 top
S1  17,85.5 270 top
SV1  3,82 90 top
SV2  13.5,64.5 90 top
SV3  38,76.5 90 top
TP1  18.5,54 0 top
TP2  18,52.5 0 top
TP3  18.5,51 0 top
U1  26.5,53 90 top
U2  14.5,75.5 270 top
U7  14,26.5 0 top
X1  13,0 0 top

### Tracks (layer width: path | path; a pad name or v marks a point on that pad's centre or on a via)
3V3A  (via drill 0.35)
  Top 0.254: U1.15 31.75,51.25 32.5,50.5 C9.1 33.4,51.3 v33.3,51.3 33.5,51.3 C8.1 33,52 32.75,52.25 U1.17 | U1.21 32.25,54.25 33,55 C7.1 33.6,54.4 v33.3,54.4 | U1.4 25.25,46.75 25.5,46.5 C11.1 | C10.1 27.25,47.05 U1.8 | U1.11 28.75,47.75 29,47.5 29.5,47 30.5,47 31,47.5 C6.1 31.7,46.3 v32,46
  Top 0.3: v25,46.6 25.15,46.75 25.25,46.75
  Top 0.305: C10.1 29.2,45.8 v29.5,45.5
  Top 0.61: L2.2 38.3,59.15 C5.1 38.45,59 v39.5,59
  Bottom 0.61: v25,46.6 28.5,46.6 29.5,45.6 v29.5,45.5 31.5,45.5 v32,46 33.3,47.3 v33.3,51.3 v33.3,54.4 33.3,58.3 33.5,58.5 39,58.5 v39.5,59
3V3D  (via drill 0.3, 0.35, 0.5)
  Top 0.2: U7.13 13.7,28.5 14.5,28.5
  Top 0.22: S1.4 16.6,85.1
  Top 0.254: U2.34 16.25,71.25 17,70.5 C22.1 18.7,70 C23.1 | C23.1 19.8,68.5 18.84,68.5 L1.1 | C23.1 19.1,68.9 v18.9,69.1 | U1.28 27.75,58.55 28.5,59.3 C14.1 | U2.48 20.45,78.25 C25.1 | U2.45 20.45,76.75 C21.1 | U2.44 19.85,76.25 C24.1 | U2.22 8.45,73.75 C20.1 | U2.13 9.55,78.25 9,78.8 C19.1 | U7.11 14.5,28.5 14.5,29.2 C34.1 | 16.6,85.1 v15,83.5 | R24.1 16,30.2 v15.9,30.2
  Top 0.3: R15.2 v27,31 26.1,31.9 R14.2 26,35.1 v26,36.5 | R13.2 21.7,35 v20.7,35 | U1.43 19.75,52.75 TP1.P$1 17.5,54 16.5,53 v16.5,52.5 | U1.44 19.25,52.25 19,52.5 TP2.P$1 v16.5,52.5 | U1.45 19.75,51.75 19,51 TP3.P$1 17.5,51 16.5,52 v16.5,52.5 | R23.2 R22.2 R21.2 14.2,47.2 v14.5,47.5
  Top 0.4: R20.2 v16.5,59.8 15.7,59 7.5,59 7.15,59.35 SV2.1 | C25.1 20.7,79.3 v20.5,79.5 | C21.1 C24.1 20.7,74.3 v21,74
  Top 0.508: C26.1 20.5,80.8 v20.5,79.5 | v9,78 9,78.8 | C20.1 8.1,75.1 v7.96,75.24
  Top 0.61: C15.1 36.55,61.15 | 36.55,61.15 L2.1 | C14.1 29.3,60.3 29.5,60.5 v32.5,60.5 34.5,60.5 35.15,61.15 36.55,61.15
  Bottom 0.3: J2.11 29.64,4 21.5,4 20.88,4.62 J2.9 15.9,10.91 v15.9,28.8 | v15,83.5 15,81 | v26,36.5 20.7,36.5 v20.7,35
  Bottom 0.4: v20.7,35 14.5,35 | v16.5,52.5 14.5,52.5 | v16.5,59.8 14.5,59.8
  Bottom 0.508: v18.9,69.1 21,71.2 v21,74 21,79 v20.5,79.5 19,81 15,81 11,81 9,79 v9,78 7.96,76.96 v7.96,75.24 3.41,75.24 SV1.1 | 14.5,57 29,57 v32.5,60.5 v33,61 v33.5,60.5 v34,61 34,66.15 SV3.1
  Bottom 0.813: v18.9,69.1 19.5,68.5 v19.5,67.6 19,67.1 v18.9,67.1 14.5,62.7 14.5,60 14.5,59.8 14.5,57 14.5,52.5 v14.5,47.5 14.5,35 14.5,33.5 16,32 16,30.3 v15.9,30.2 v15.9,29.5 v15.9,28.8
  pour Top (no thermals): 14.2,27.5 14.2,30.5 16.2,30.5 16.2,28.9 15.8,28.5 15.2,28.5 14.9,28.2 14.9,27.6 14.8,27.5
  pour Top (no thermals): 18.5,71 18.5,69 18.5,68.5 17.5,67.5 18.5,66.5 19,66.5 19.5,67 20,67.5 20,69.5 19.5,69.5 19,69.5 19,71
  pour Top: 32.5,61.5 32.5,60 34.5,60 34.5,61.5
ANT_CTRL  (via drill 0.35)
  Top 0.22: S1.6 18.7,85.3 | U2.5 15.25,81.55 15,81.8
  Top 0.254: 15,81.8 R4.2 | 18.7,85.3 v19,85
  Top 0.3: v15.8,82 R4.2
  Bottom 0.3: v19,85 18.8,85 v15.8,82
BIAS
  Top 0.254: U7.5 13.7,23.9 C33.1
C_RESET  (via drill 0.35)
  Top 0.254: U2.35 16.75,71.45 17,71.2 v17.8,71.2 | SV2.10 13.32,66.18 v13.5,66 14.5,65 C32.1 R20.1
  Bottom 0.4: v17.8,71.2 13.5,66.9 v13.5,66
C_UART0_RX  (via drill 0.35)
  Top 0.254: U2.20 10.1,74.75 9.75,75.1 9.4,75.1 v9,75.5
  Top 0.3: R5.1 4,42.84 v4.66,43.5
  Bottom 0.3: v9,75.5 9,75.08 6.41,72.49 6.41,71 5.91,70.5 5.15,70.5 4.66,70.01 v4.66,43.5
C_UART0_TX  (via drill 0.35)
  Top 0.254: U2.21 9.75,74.25 v9.5,74.5
  Top 0.3: R6.1 6,43 v5.5,43.5
  Bottom 0.3: v9.5,74.5 7.25,72.25 7.25,70.65 6.26,69.66 5.5,69.66 v5.5,43.5
FPWM
  Top 0.254: U7.14 12.2,27.8 10.5,29.5 JP4.2
GND  (via drill 0.3, 0.35, 0.5, 1)
  Top 0.22: S1.2 17,86.5
  Top 0.3: C12.2 27.8,24.8 v27.5,24.5 | 4.5,24.5 IC1.3 4.5,22.95 4.33,22.77 4.08,22.77 4.08,22.5 3.5,22.5 | 4.5,24.5 4.5,25 | IC1.EXP 4.5,26 4.5,24.5
  other vias: 3,72.5 5,26 6,27 6,25 4,25 4,27 13.4,90 14,89.5 14.6,88.9 15.1,88.3 15.7,87.8 16.3,87.2 16.9,86.7 17.1,87.5 17.4,88.2 17.9,88.8 18.4,89.3 19,89.9 19.5,90.5 20.1,91.1 20.7,91.6 21.3,92.2 21.5,93 21.5,93.8 23.5,93.8 23.5,93.1 24.6,92 22.8,90.8 22.2,90.1 21.7,89.6 21.1,89 20.5,88.5 19.9,88 19.5,87.4 15.4,85.2 14.9,85.7 14.3,86.2 13.8,86.8 13.2,87.4 12.6,88 12.2,88.6 11.7,89.1 11.2,89.7 10.9,90.3 10.7,91 12.9,90.5 12.5,91.1 10.4,91.7 12.5,91.8 2.9,69.7 2.9,65.2 2.4,59.2 3.9,53.2 1.4,45.7 1.4,42.2 1.4,36.7 0.9,21.7 1.4,18.7 1.4,10.7 3.9,9.7 15.9,8.2 20.4,2.7 26.4,2.7 32.4,2.7 41.9,9.2 41.4,19.2 41.4,31.2 41.4,42.7 39.9,52.2 37.4,55.7 37.4,49.7 41.9,58.2 41.9,73.2 41.4,85.2 41.4,93.7 35.9,93.7 30.9,93.7 26.4,93.7 26,67.5 33,70 27.5,82.5 12,40 11,52 34.5,23 34.5,29.5
  pour Top (rank 5): 45,94.5 -1,94.5 -1,94 -1,0 46.5,0 46.5,94.5
  pour Bottom (rank 5): 45,94.5 -1,94.5 -1,94 -1,0 46.5,0 46.5,94.5
LED1  (via drill 0.3)
  Top 0.254: v13.7,80.1 13.46,79.86 13.21,79.86 12.75,79.4 U2.10
  Top 0.3: LED1.C v12.5,56.5
  Bottom 0.3: v12.5,56.5 12.5,63.41 12.7,63.6 12.7,64.51 12.54,64.67 12.54,78.94 v13.7,80.1
LED2  (via drill 0.3)
  Top 0.254: U2.11 12.25,79.85 v12.5,80.1 | LED2.C v9.5,56.5
  Bottom 0.254: v9.5,56.5 11,58 11,61.5 10,62.5 10,64.5 11.5,66 11.5,79.1 v12.5,80.1
LED3  (via drill 0.3)
  Top 0.254: U2.12 11.75,79.7 v11.37,80.08 | v6.5,56.5 6,56 LED3.C
  Bottom 0.254: v11.37,80.08 10.5,79.2 10.5,68 9,66.5 9,59 v6.5,56.5
LX1
  Top 0.254: U7.8 16.95,25.9 L7.2
  pour Top (no thermals): 15.5,26 15.5,25.5 16,25 17,25 17,26
LX2
  Top 0.254: U7.10 17.05,27.2 L7.1
  pour Top (no thermals): 15.5,27.5 16,28 17.5,28 17.5,27 15.5,27
N$1
  Top 0.254: U1.30 26.75,58.25 27.8,59.3 R1.2 28.8,61.5 30.5,61.5 31.5,62.5 31.5,63 Q1.3 33.1,63.3 C2.1
N$2
  Top 0.254: U1.31 26.25,60.45 R1.1 26.2,62.4 R2.2
N$3
  Top 0.254: R2.1 26.5,65.4 Q1.1 28.8,69.9 C1.1
N$4
  Top 0.254: U1.22 31.75,54.75 33.5,56.5 C4.1
N$5
  Top 0.254: U1.10 28.25,47.25 29,46.5 30,46.5 30.5,46 R3.2
N$6
  Top 0.22: S1.1 17.77,86.07
  Top 0.3: 17.77,86.07 arc45 C16.1
  Top 0.61: C37.2 18.62,88.12 arc45 C16.1
N$7
  Top 0.254: U1.20 33.95,53.75 C3.1
N$8
  Top 0.254: U2.14 9.6,77.75 9.25,77.4 8.75,77.4 8.4,77.75 7.5,77.75 6.2,79.05 6.2,84.61 5,85.81 SV1.5
N$9
  Top 0.22: S1.5 17,83.59
  Top 0.254: 17,83.59 FL2.1
N$10
  Top 0.254: U2.15 9.67,77.25 9.42,76.99 8.58,76.99 8.33,77.25 7.03,77.25 5.6,78.68 5.6,82.4 4.73,83.27 SV1.4
N$11
  Top 0.254: U2.16 9.74,76.75 9.58,76.59 8.42,76.59 8.26,76.75 6.46,76.75 5,78.21 5,80.5 4.77,80.73 SV1.3
N$12
  Top 0.254: U2.17 9.81,76.25 9.75,76.19 8.25,76.19 8.19,76.25 4.94,76.25 SV1.2
N$13
  Top 0.22: S1.3 16.56,85.74 arc-45 16.05,85.95
  Top 0.61: 16.05,85.95 12.24,89.76 arc-45 11.5,91.55 J3.SIG
N$14
  Top 0.254: U2.37 19.25,72.75 20.4,71.6 23.53,71.6 27.43,75.5 32.5,75.5 35.31,72.69 SV3.2
N$15
  Top 0.508: 22.5,92.05 C38.2
  Top 0.61: E1.ANT 22.5,92.05 | C38.2 20.89,90.44 C37.1
N$16
  Top 0.254: U2.38 19.39,73.25 20.59,72.06 23.34,72.06 27.24,75.95 32.62,75.95 33.34,75.23 SV3.3
N$17
  Top 0.254: U2.39 19.53,73.75 20.77,72.51 23.15,72.51 27.05,76.41 32.62,76.41 33.98,77.77 SV3.4
N$18
  Top 0.3: J2.2 24.32,21.32 26.2,23.2 C12.1 26.2,27.4 R15.1
N$19
  Top 0.254: U2.40 19.68,74.25 20.96,72.96 22.96,72.96 26.86,76.86 32.5,76.86 35.95,80.31 SV3.5
N$20
  Top 0.254: U2.23 9.75,73.25 8.9,72.4 C27.1
N$21
  Top 0.3: J2.12 38.88,10.7 R18.2
N$22  (via drill 0.35)
  Top 0.3: v27.5,33.5 27.5,35 R16.1 | v32.5,33.5 32.5,35 | 32.5,35 32.4,35.1 R17.1 | 32.5,35 C18.2
  Bottom 0.3: J2.5 28.14,19.36 25.5,22 25.5,31.5 v27.5,33.5 v32.5,33.5
N$23
  Top 0.3: J2.10 21.63,7.72 18.48,7.72 R19.2
N$24
  Top 0.254: R24.2 14.95,33.3 LED4.A
N$25
  Top 0.254: U2.33 15.74,71 15.74,70.99 15.74,70.26 L1.2
N$27
  Top 0.3: X1.S3 10.07,1.15 9.99,1.15 9.35,1.79 X1.S1 11.39,3.7 11.44,3.75 14.56,3.75 14.61,3.7 X1.S2 16.65,1.79 16.01,1.15 15.93,1.15 X1.S4
N$29
  Top 0.3: R21.1 LED1.A
N$30
  Top 0.3: IC1.6 6,23.1 6.05,23.05 6.05,22.58 6.2,22.43 C28.2
N$31
  Top 0.3: R22.1 LED2.A
N$32
  Top 0.3: R23.1 LED3.A
RD_N  (via drill 0.35)
  Top 0.305: C17.2 29,29.89 29.52,29.37 29.52,28.96 arc90 30.32,28.16 30.85,28.16 arc-90 31.19,27.82 31.19,27.68 arc-90 30.85,27.34 30.32,27.34 arc90 29.52,26.55 29.52,26.41 arc90 30.32,25.61 30.53,25.61 arc-90 30.87,25.27 30.87,25.14 arc-90 30.53,24.8 30.32,24.8 arc90 29.52,24 29.52,23.52 28,22 v27.5,22
  Bottom 0.305: v27.5,22 29.41,20.09 J2.6
RD_P
  Top 0.305: C13.2 30.5,29.89 29.98,29.37 29.98,28.96 arc90 30.32,28.62 30.85,28.62 arc-90 31.64,27.82 31.64,27.68 arc-90 30.85,26.89 30.32,26.89 arc90 29.98,26.55 29.98,26.41 arc90 30.32,26.07 30.85,26.07 arc-90 31.64,25.27 31.64,25.14 arc-90 30.85,24.34 30.32,24.34 arc90 29.98,24 29.98,23.33 26.86,20.22 J2.4
RF_N
  Top 0.3: U2.2 16.75,80.75 17.09,81.09 FL2.3
RF_P
  Top 0.3: U2.1 17.25,80.25 17.91,80.91 FL2.4
RX_N
  Top 0.305: U1.5 25.75,47.36 25.93,47.18 25.93,46.93 26.68,46.18 26.68,42.68 29.5,39.86 29.5,38.8 R11.2
RX_P
  Top 0.305: U1.6 26.25,47.5 26.38,47.37 26.38,47.12 27,46.5 27.13,46.37 27.13,42.87 29.95,40.05 29.95,38.84 R12.2
RXD
  Top 0.3: IC1.26 1.5,25.5 1,26 1,31.5 4,34.5 R5.2
SEL
  Top 0.254: U7.1 R7.1
TCK
  Top 0.254: SV2.4 8.42,68.82 11.16,71.56 11.65,71.56 11.75,71.67 U2.25
TDI
  Top 0.254: U2.27 12.75,71.22 10.96,69.43 SV2.8
TDO
  Top 0.254: U2.26 12.25,71.45 11.8,71 11.4,71 9.69,69.29 SV2.6
TMS
  Top 0.254: SV2.2 7.15,68.65 9.5,71 9.5,72 10.25,72.75 U2.24
TX_N
  Top 0.305: U1.1 23.75,47.43 23.77,47.43 23.77,45.5 arc-90 23.43,45.16 23.31,45.16 arc90 22.52,44.37 22.52,43.39 arc90 23.31,42.6 23.43,42.6 arc-90 23.77,42.26 23.77,38.87 R9.2
TX_P
  Top 0.305: U1.2 24.25,47.43 24.23,47.43 24.23,45.5 arc-90 23.43,44.7 23.31,44.7 arc90 22.97,44.37 22.97,43.39 arc90 23.31,43.05 23.43,43.05 arc-90 24.23,42.26 24.23,38.77 R10.2
TXD
  Top 0.3: IC1.25 1.64,26 1.5,26.14 1.5,31 3.5,33 4,33 6,35 R6.2
USB_N  (via drill 0.35)
  Top 0.3: IC1.5 5.5,22.6 4.97,22.07 4.97,14.53 5.81,13.69 8,11.5 8.5,11 8.5,10.26 v8.93,9.82 | X1.2 v12.2,8
  Bottom 0.3: v12.2,8 12.2,8.8 11,10 9,10 8.93,9.93 v8.93,9.82
USB_P  (via drill 0.35)
  Top 0.3: IC1.4 5,22.8 4.53,22.32 4.53,14.34 7.5,11.36 v7.5,10.5 | X1.3 v13,8
  Bottom 0.3: v13,8 13,8.64 11.19,10.45 7.55,10.45 v7.5,10.5
VCC5
  Top 0.254: C35.1 14.3,24.4 U7.6 14.3,25.7 14,26 U7.3
  Top 0.508: 11.4,7.1 X1.1
  Top 0.813: C35.1 15.2,21 | 15.2,21 15.2,15.2 10.5,10.5 10.5,8 11.4,7.1 | R8.2 15.2,21
  pour Top (no thermals): 14.2,25.6 14.2,22.8 14.5,22.5 16,22.5 16,24.3 15.7,24.6 15.1,24.6 14.8,24.9 14.8,25.6
VUSB
  Top 0.813: R8.1 11.3,21 C29.1
  pour Top: 6.5,23 6.5,24 7,24 7,24.5 8,24.5 8.5,24 10,24 10,22.5 7,22.5
W_ACTLED  (via drill 0.35)
  Top 0.254: U1.27 28.25,52.25 28,52 v27.5,52
  Top 0.3: R18.1 39,22.5 38,23.5 v38,38.5
  Bottom 0.3: v27.5,52 22,46.5 22,43 24.5,40.5 36,40.5 v38,38.5
W_CLK
  Top 0.254: U2.31 14.75,68.55 23.29,60.01 24.43,60.01 25.25,59.19 U1.33
W_CS
  Top 0.254: U2.32 15.25,68.75 23.49,60.51 24.7,60.51 25.75,59.46 U1.32
W_INT
  Top 0.254: U2.28 13.25,67.84 22.59,58.5 23.5,58.5 23.75,58.25 U1.36
W_LINKLED  (via drill 0.35)
  Top 0.254: U1.25 29.25,55.75 v29,55.5
  Top 0.3: R19.1 16,13.5 19.5,17 19.5,22.5 21.5,24.5 21.5,32 19,34.5 19,45.5 v20,46.5
  Bottom 0.3: v20,46.5 v29,55.5
W_MISO
  Top 0.254: U2.30 14.25,68.35 23.1,59.5 24.17,59.5 24.75,58.92 U1.34
W_MOSI
  Top 0.254: U2.29 13.75,68.15 22.9,59 23.8,59 24.25,58.55 U1.35
W_RX_N
  Top 0.305: C17.1 29.52,33.12 29.52,33.67 29.2,33.99 R16.2 29.2,36.5 R11.1
W_RX_P
  Top 0.305: C13.1 29.98,33.12 29.98,33.67 30.3,33.99 R17.2 30.3,36.5 R12.1
W_TX_N  (via drill 0.35)
  Top 0.305: v21.5,18.5 22,19 22.05,19 22.05,22.05 22.5,22.5 23.72,23.72 23.72,28.64 23.72,32 23.72,33 23.72,33.67 23.4,33.99 R13.1 23.4,36.5 R9.1
  Bottom 0.305: J2.3 24.5,17.45 24.5,17.5 24.3,17.7 22.3,17.7 v21.5,18.5
W_TX_P
  Top 0.305: J2.1 22.5,16.91 22.5,21.86 22.82,22.18 24.18,23.53 24.18,28.64 arc-90 24.52,28.98 24.85,28.98 arc90 25.19,29.32 25.19,29.53 arc90 24.85,29.87 24.52,29.87 arc-90 24.18,30.21 24.18,30.43 arc-90 24.52,30.77 24.85,30.77 arc90 25.19,31.11 25.19,31.32 arc90 24.85,31.66 24.52,31.66 arc-90 24.18,32 24.18,33 24.18,33.67 24.5,33.99 R14.1 24.5,36.5 R10.1

### Text on the board
tPlace: mSniff / OK v01 05/2023